# Altium project obc_ver2.PrjPcb (part 3 of 3)

## Sheet obc-v2_MCU-PinOut.SchDoc
size 420 x 297 mm; SheetNumber: 23; SheetTotal: 23
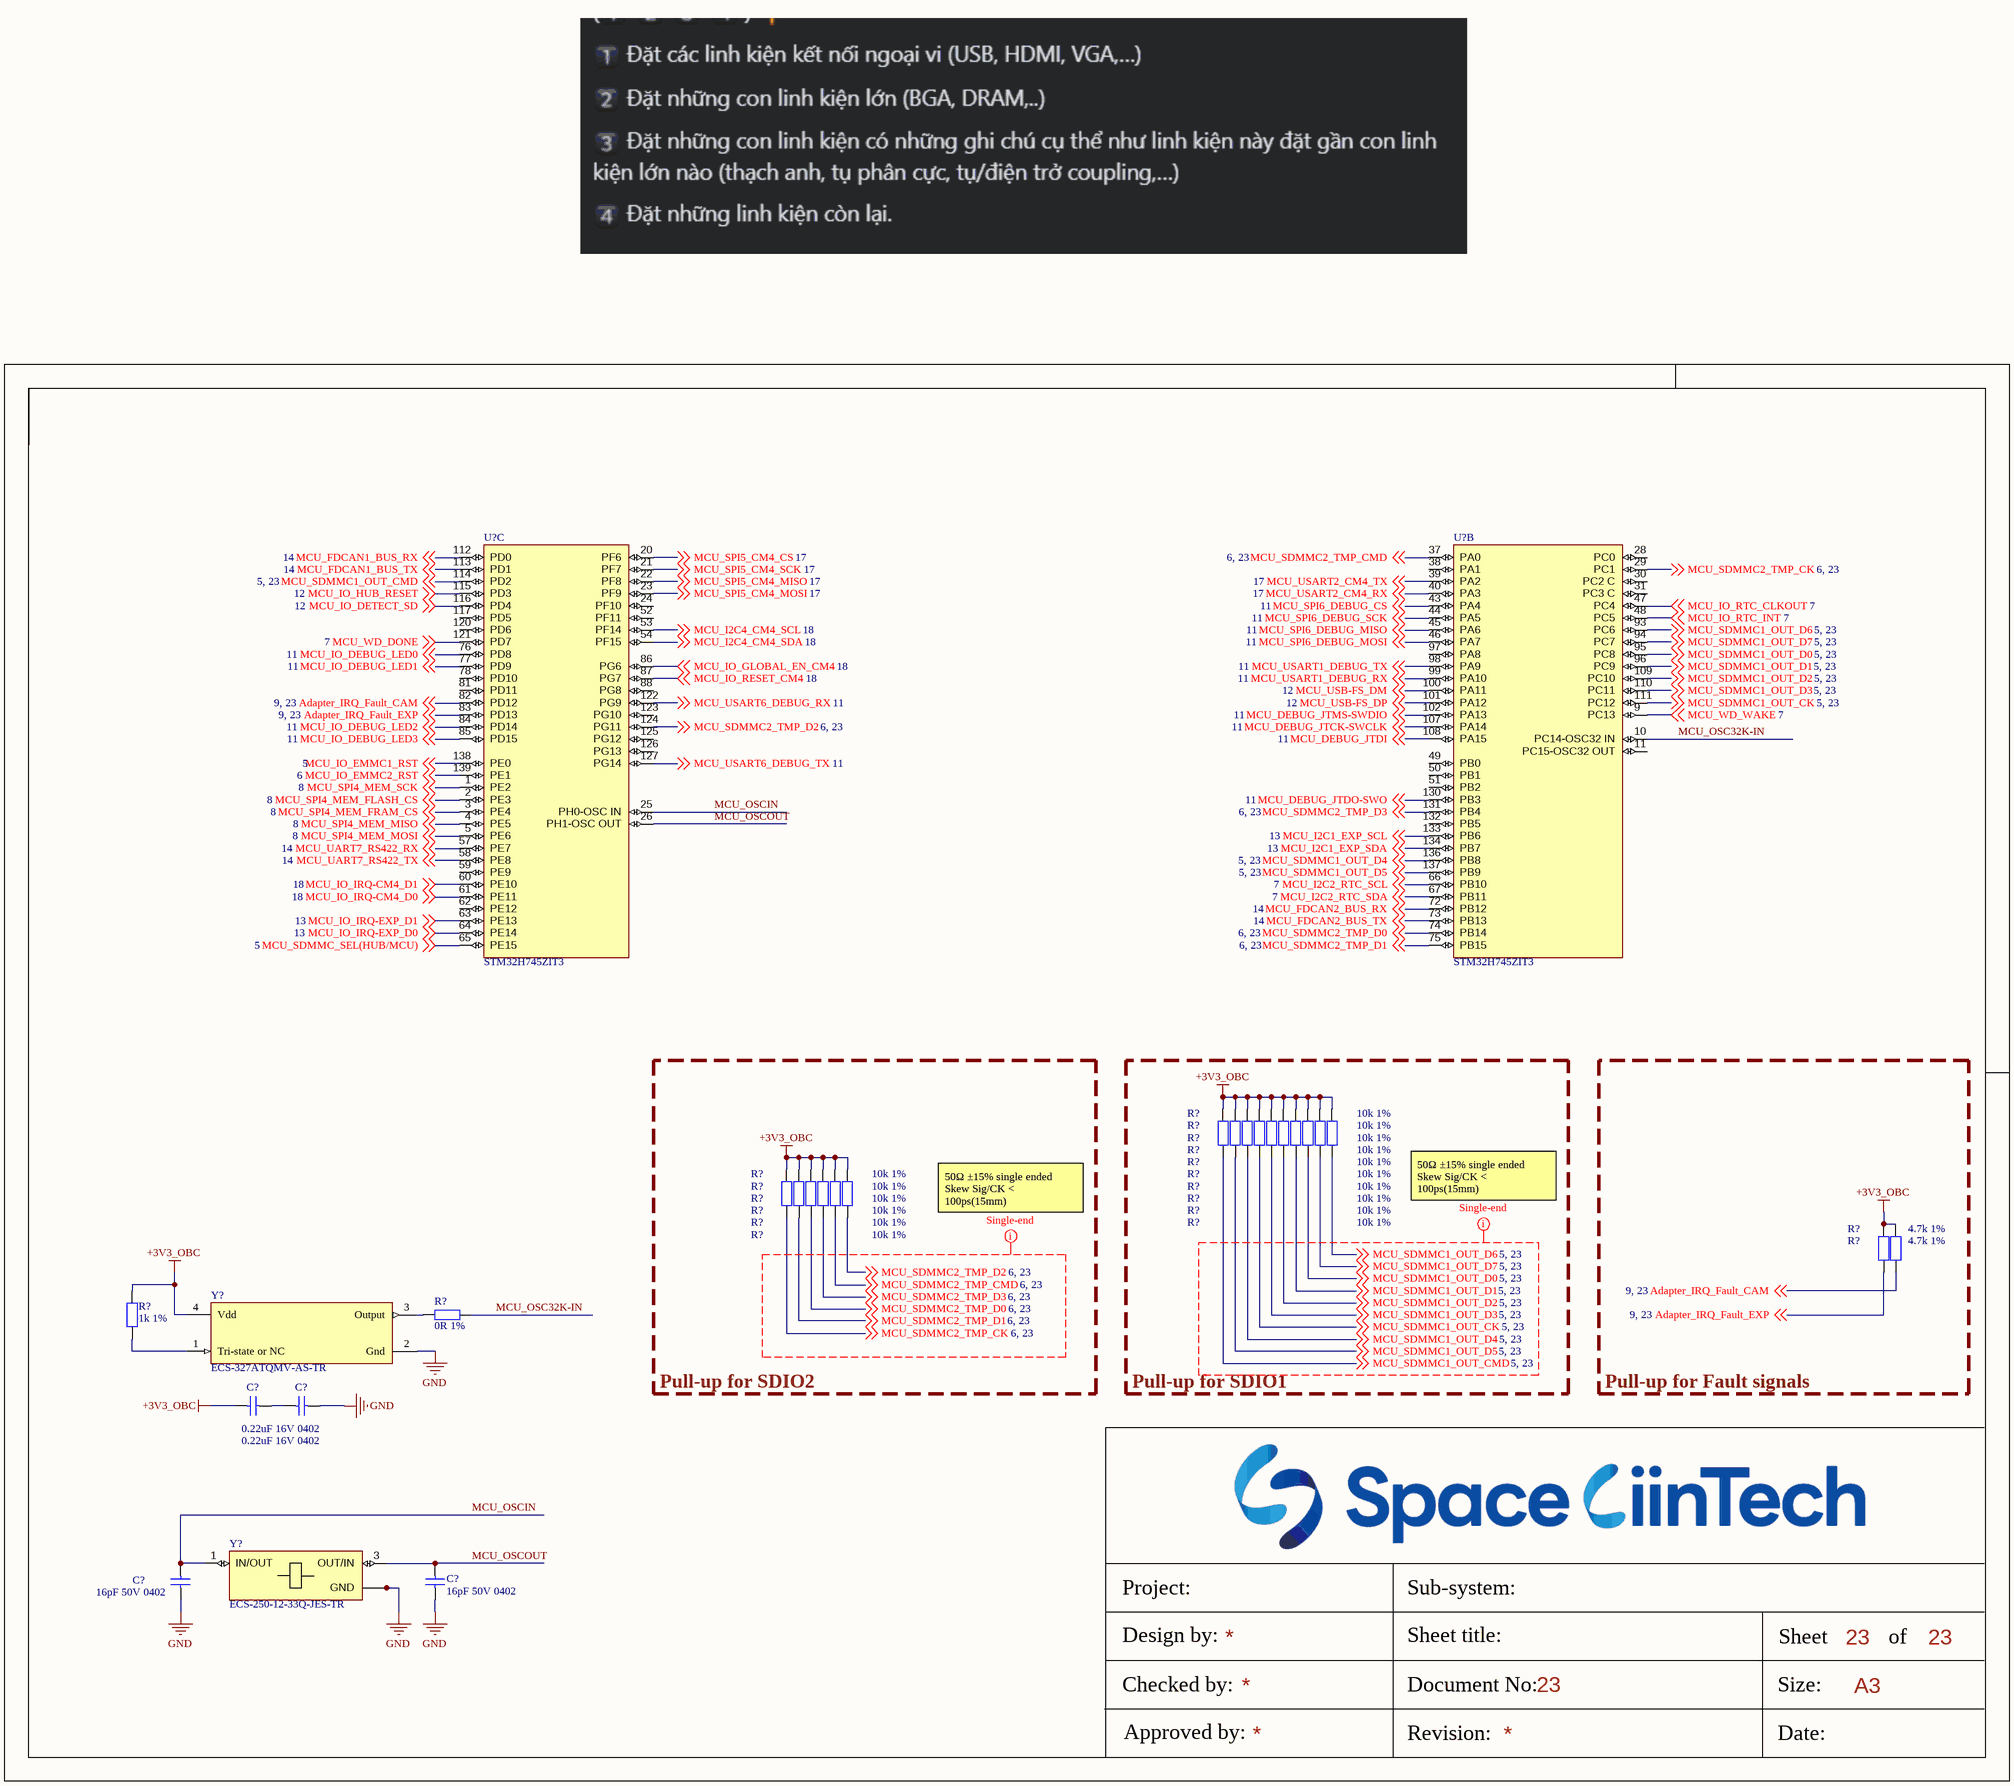
[diagram p23: obc-v2_MCU-PinOut.SchDoc]

### Parts
(Parts that share a designator on the sheet are numbered #1, #2 ... from top to bottom, then left to right.)
C?#221  0.22uF 16V 0402  [tu 0402]
C?#222  0.22uF 16V 0402  [tu 0402]
C?#223  16pF 50V 0402  [tu 0402]
C?#224  16pF 50V 0402  [tu 0402]
R?#90  10k 1%  [tro smd 0603]
R?#91  10k 1%  [tro smd 0603]
R?#92  10k 1%  [tro smd 0603]
R?#93  10k 1%  [tro smd 0603]
R?#94  10k 1%  [tro smd 0603]
R?#95  10k 1%  [tro smd 0603]
R?#96  10k 1%  [tro smd 0603]
R?#97  10k 1%  [tro smd 0603]
R?#98  10k 1%  [tro smd 0603]
R?#99  10k 1%  [tro smd 0603]
R?#100  10k 1%  [tro smd 0603]
R?#101  10k 1%  [tro smd 0603]
R?#102  10k 1%  [tro smd 0603]
R?#103  10k 1%  [tro smd 0603]
R?#104  10k 1%  [tro smd 0603]
R?#105  10k 1%  [tro smd 0603]
R?#106  4.7k 1%  [tro smd 0603]
R?#107  4.7k 1%  [tro smd 0603]
R?#108  1k 1%  [tro smd 0603]
R?#109  0R 1%  [tro smd 0603]
U?#30  STM32H745ZIT3  [FP-LQFP144-1A-MFG]  (part C of 3)
U?#31  STM32H745ZIT3  [FP-LQFP144-1A-MFG]  (part B of 3)
Y?#3  ECS-327ATQMV-AS-TR  [FP-327ATQMV-MFG]
Y?#4  ECS-250-12-33Q-JES-TR  [XTAL_ECS-250-12-33Q-JES-TR]

### Blocks framed on the sheet
Pull-up for SDIO2: R?#100-R?#105
Pull-up for SDIO1: R?#90-R?#99
Pull-up for Fault signals: R?#106 R?#107

### Nets
+3V3_OBC: C?#221.1 R?#90.2 R?#91.2 R?#92.2 R?#93.2 R?#94.2 R?#95.2 R?#96.2 R?#97.2 R?#98.2 R?#99.2 R?#100.2 R?#101.2 R?#102.2 R?#103.2 R?#104.2 R?#105.2 R?#106.2 R?#107.2 R?#108.1 Y?#3.4(Vdd)
GND: C?#222.2 C?#223.1 C?#224.1 Y?#3.2(Gnd) Y?#4.2(GND) Y?#4.4(GND)
Adapter_IRQ_Fault_CAM: R?#107.1 U?#30.82(PD12) ; off-sheet Adapter_IRQ_Fault_CAM
Adapter_IRQ_Fault_EXP: R?#106.1 U?#30.83(PD13) ; off-sheet Adapter_IRQ_Fault_EXP
MCU_DEBUG_JTCK-SWCLK: U?#31.107(PA14) ; off-sheet MCU_DEBUG_JTCK-SWCLK
MCU_DEBUG_JTDI: U?#31.108(PA15) ; off-sheet MCU_DEBUG_JTDI
MCU_DEBUG_JTDO-SWO: U?#31.130(PB3) ; off-sheet MCU_DEBUG_JTDO-SWO
MCU_DEBUG_JTMS-SWDIO: U?#31.102(PA13) ; off-sheet MCU_DEBUG_JTMS-SWDIO
MCU_FDCAN1_BUS_RX: U?#30.112(PD0) ; off-sheet MCU_FDCAN1_BUS_RX
MCU_FDCAN1_BUS_TX: U?#30.113(PD1) ; off-sheet MCU_FDCAN1_BUS_TX
MCU_FDCAN2_BUS_RX: U?#31.72(PB12) ; off-sheet MCU_FDCAN2_BUS_RX
MCU_FDCAN2_BUS_TX: U?#31.73(PB13) ; off-sheet MCU_FDCAN2_BUS_TX
MCU_I2C1_EXP_SCL: U?#31.133(PB6) ; off-sheet MCU_I2C1_EXP_SCL
MCU_I2C1_EXP_SDA: U?#31.134(PB7) ; off-sheet MCU_I2C1_EXP_SDA
MCU_I2C2_RTC_SCL: U?#31.66(PB10) ; off-sheet MCU_I2C2_RTC_SCL
MCU_I2C2_RTC_SDA: U?#31.67(PB11) ; off-sheet MCU_I2C2_RTC_SDA
MCU_I2C4_CM4_SCL: U?#30.53(PF14) ; off-sheet MCU_I2C4_CM4_SCL
MCU_I2C4_CM4_SDA: U?#30.54(PF15) ; off-sheet MCU_I2C4_CM4_SDA
MCU_IO_DEBUG_LED0: U?#30.76(PD8) ; off-sheet MCU_IO_DEBUG_LED0
MCU_IO_DEBUG_LED1: U?#30.77(PD9) ; off-sheet MCU_IO_DEBUG_LED1
MCU_IO_DEBUG_LED2: U?#30.84(PD14) ; off-sheet MCU_IO_DEBUG_LED2
MCU_IO_DEBUG_LED3: U?#30.85(PD15) ; off-sheet MCU_IO_DEBUG_LED3
MCU_IO_DETECT_SD: U?#30.116(PD4) ; off-sheet MCU_IO_DETECT_SD  [project net MCU_DETECT_SD]
MCU_IO_EMMC1_RST: U?#30.138(PE0) ; off-sheet MCU_IO_EMMC1_RST  [project net EMMC1_RST]
MCU_IO_EMMC2_RST: U?#30.139(PE1) ; off-sheet MCU_IO_EMMC2_RST  [project net EMMC2_RST]
MCU_IO_GLOBAL_EN_CM4: U?#30.86(PG6) ; off-sheet MCU_IO_GLOBAL_EN_CM4
MCU_IO_HUB_RESET: U?#30.115(PD3) ; off-sheet MCU_IO_HUB_RESET
MCU_IO_IRQ-CM4_D0: U?#30.61(PE11) ; off-sheet MCU_IO_IRQ-CM4_D0
MCU_IO_IRQ-CM4_D1: U?#30.60(PE10) ; off-sheet MCU_IO_IRQ-CM4_D1
MCU_IO_IRQ-EXP_D0: U?#30.64(PE14) ; off-sheet MCU_IO_IRQ-EXP_D0
MCU_IO_IRQ-EXP_D1: U?#30.63(PE13) ; off-sheet MCU_IO_IRQ-EXP_D1
MCU_IO_RESET_CM4: U?#30.87(PG7) ; off-sheet MCU_IO_RESET_CM4
MCU_IO_RTC_CLKOUT: U?#31.47(PC4) ; off-sheet MCU_IO_RTC_CLKOUT
MCU_IO_RTC_INT: U?#31.48(PC5) ; off-sheet MCU_IO_RTC_INT
MCU_OSC32K-IN: R?#109.1 U?#31.10(PC14-OSC32_IN)
MCU_OSCIN: C?#223.2 U?#30.25(PH0-OSC_IN) Y?#4.1(IN/OUT)
MCU_OSCOUT: C?#224.2 U?#30.26(PH1-OSC_OUT) Y?#4.3(OUT/IN)
MCU_SDMMC1_OUT_CK: R?#93.1 U?#31.111(PC12) ; off-sheet MCU_SDMMC1_OUT_CK
MCU_SDMMC1_OUT_CMD: R?#90.1 U?#30.114(PD2) ; off-sheet MCU_SDMMC1_OUT_CMD
MCU_SDMMC1_OUT_D0: R?#97.1 U?#31.95(PC8) ; off-sheet MCU_SDMMC1_OUT_D0
MCU_SDMMC1_OUT_D1: R?#96.1 U?#31.96(PC9) ; off-sheet MCU_SDMMC1_OUT_D1
MCU_SDMMC1_OUT_D2: R?#95.1 U?#31.109(PC10) ; off-sheet MCU_SDMMC1_OUT_D2
MCU_SDMMC1_OUT_D3: R?#94.1 U?#31.110(PC11) ; off-sheet MCU_SDMMC1_OUT_D3
MCU_SDMMC1_OUT_D4: R?#92.1 U?#31.136(PB8) ; off-sheet MCU_SDMMC1_OUT_D4
MCU_SDMMC1_OUT_D5: R?#91.1 U?#31.137(PB9) ; off-sheet MCU_SDMMC1_OUT_D5
MCU_SDMMC1_OUT_D6: R?#99.1 U?#31.93(PC6) ; off-sheet MCU_SDMMC1_OUT_D6
MCU_SDMMC1_OUT_D7: R?#98.1 U?#31.94(PC7) ; off-sheet MCU_SDMMC1_OUT_D7
MCU_SDMMC2_TMP_CK: R?#100.1 U?#31.29(PC1) ; off-sheet MCU_SDMMC2_TMP_CK  [project net EMMC2_CLK]
MCU_SDMMC2_TMP_CMD: R?#104.1 U?#31.37(PA0) ; off-sheet MCU_SDMMC2_TMP_CMD  [project net EMMC2_CMD]
MCU_SDMMC2_TMP_D0: R?#102.1 U?#31.74(PB14) ; off-sheet MCU_SDMMC2_TMP_D0  [project net EMMC2_DAT0]
MCU_SDMMC2_TMP_D1: R?#101.1 U?#31.75(PB15) ; off-sheet MCU_SDMMC2_TMP_D1  [project net EMMC2_DAT1]
MCU_SDMMC2_TMP_D2: R?#105.1 U?#30.124(PG11) ; off-sheet MCU_SDMMC2_TMP_D2  [project net EMMC2_DAT2]
MCU_SDMMC2_TMP_D3: R?#103.1 U?#31.131(PB4) ; off-sheet MCU_SDMMC2_TMP_D3  [project net EMMC2_DAT3]
MCU_SDMMC_SEL(HUB/MCU): U?#30.65(PE15) ; off-sheet MCU_SDMMC_SEL(HUB/MCU)
MCU_SPI4_MEM_FLASH_CS: U?#30.2(PE3) ; off-sheet MCU_SPI4_MEM_FLASH_CS
MCU_SPI4_MEM_FRAM_CS: U?#30.3(PE4) ; off-sheet MCU_SPI4_MEM_FRAM_CS
MCU_SPI4_MEM_MISO: U?#30.4(PE5) ; off-sheet MCU_SPI4_MEM_MISO
MCU_SPI4_MEM_MOSI: U?#30.5(PE6) ; off-sheet MCU_SPI4_MEM_MOSI
MCU_SPI4_MEM_SCK: U?#30.1(PE2) ; off-sheet MCU_SPI4_MEM_SCK
MCU_SPI5_CM4_CS: U?#30.20(PF6) ; off-sheet MCU_SPI5_CM4_CS
MCU_SPI5_CM4_MISO: U?#30.22(PF8) ; off-sheet MCU_SPI5_CM4_MISO
MCU_SPI5_CM4_MOSI: U?#30.23(PF9) ; off-sheet MCU_SPI5_CM4_MOSI
MCU_SPI5_CM4_SCK: U?#30.21(PF7) ; off-sheet MCU_SPI5_CM4_SCK
MCU_SPI6_DEBUG_CS: U?#31.43(PA4) ; off-sheet MCU_SPI6_DEBUG_CS
MCU_SPI6_DEBUG_MISO: U?#31.45(PA6) ; off-sheet MCU_SPI6_DEBUG_MISO
MCU_SPI6_DEBUG_MOSI: U?#31.46(PA7) ; off-sheet MCU_SPI6_DEBUG_MOSI
MCU_SPI6_DEBUG_SCK: U?#31.44(PA5) ; off-sheet MCU_SPI6_DEBUG_SCK
MCU_UART7_RS422_RX: U?#30.57(PE7) ; off-sheet MCU_UART7_RS422_RX  [project net MCU_RS422_RX]
MCU_UART7_RS422_TX: U?#30.58(PE8) ; off-sheet MCU_UART7_RS422_TX  [project net MCU_RS422_TX]
MCU_USART1_DEBUG_RX: U?#31.99(PA10) ; off-sheet MCU_USART1_DEBUG_RX
MCU_USART1_DEBUG_TX: U?#31.98(PA9) ; off-sheet MCU_USART1_DEBUG_TX
MCU_USART2_CM4_RX: U?#31.40(PA3) ; off-sheet MCU_USART2_CM4_RX
MCU_USART2_CM4_TX: U?#31.39(PA2) ; off-sheet MCU_USART2_CM4_TX
MCU_USART6_DEBUG_RX: U?#30.122(PG9) ; off-sheet MCU_USART6_DEBUG_RX
MCU_USART6_DEBUG_TX: U?#30.127(PG14) ; off-sheet MCU_USART6_DEBUG_TX
MCU_USB-FS_DM: U?#31.100(PA11) ; off-sheet MCU_USB-FS_DM  [project net MCU_USB-FS_HUB_D_N]
MCU_USB-FS_DP: U?#31.101(PA12) ; off-sheet MCU_USB-FS_DP  [project net MCU_USB-FS_HUB_D_P]
MCU_WD_DONE: U?#30.121(PD7) ; off-sheet MCU_WD_DONE
MCU_WD_WAKE: U?#31.9(PC13) ; off-sheet MCU_WD_WAKE
NetC?#221_2: C?#221.2 C?#222.1
NetR?#108_2: R?#108.2 Y?#3.1(Tri-state_or_NC)
NetR?#109_2: R?#109.2 Y?#3.3(Output)

Not connected (* = marked no-connect by the designer): U?#30 24(PF10) 52(PF11) 59(PE9) 62(PE12) 78(PD10) 81(PD11) 88(PG8) 117(PD5) 120(PD6) 123(PG10) 125(PG12) 126(PG13); U?#31 11(PC15-OSC32_OUT) 28(PC0) 30(PC2_C) 31(PC3_C) 38(PA1) 49(PB0) 50(PB1) 51(PB2) 97(PA8) 132(PB5)

### Layout directives
mark named Single-end: MCU_SDMMC1_OUT_CK, MCU_SDMMC1_OUT_CMD, MCU_SDMMC1_OUT_D0, MCU_SDMMC1_OUT_D1, MCU_SDMMC1_OUT_D2, MCU_SDMMC1_OUT_D3, MCU_SDMMC1_OUT_D4, MCU_SDMMC1_OUT_D5, MCU_SDMMC1_OUT_D6, MCU_SDMMC1_OUT_D7, MCU_SDMMC2_TMP_CK, MCU_SDMMC2_TMP_CMD, MCU_SDMMC2_TMP_D0, MCU_SDMMC2_TMP_D1, MCU_SDMMC2_TMP_D2, MCU_SDMMC2_TMP_D3

### Notes on the sheet
- 50Ω ±15% single ended
  Skew Sig/CK < 100ps(15mm)
  Max Length 100mm
- Project:
- Sub-system:
- Design by:
- Sheet title:
- Sheet
- A3
- of
- Checked by:
- Approved by:
- Revision:
- Document No:
- Size:
- Date:

### Library data of the parts
C?#221 C?#222 = Tu 0402 33nF 10V: as C?#128-C?#141 on sheet obc-v2_CM4-PinOut; Kieu_Chan: *
C?#223 C?#224 = Tu 0402 33nF 10V: 16 pF ±1% 50V Ceramic Capacitor C0G, NP0 0402 (1005 Metric): GJM1555C1H160FB01J; Chung_Loai: Dán; Don_Vi: Con; So_Chan: 2; Ten_Linh_Kien: Tụ 0402 33nF X7R 10V GRM155R71A333KA01D; Ma_Hang: MH007853; Kieu_Chan: *
R?#90-R?#109 = Tro 0603 1% 10k: RES 4.7K OHM 1% 1/10W 0603, P/N: ERJ-U03F4701V; Chung_Loai: Dán; Don_Vi: Con; So_Chan: 2; Ten_Linh_Kien: Trở 0603 1% 10k; Ma_Hang: MH006333; Kieu_Chan: *
U?#30 U?#31 = CMP-12105-000054-1: HIGH-PERFORMANCE AND DSP WITH DP; Manufacturer Part Number: STM32H745ZIT6; Manufacturer: STMicroelectronics; Number Of Timers/Counters: 20; Min Supply Voltage: 1.62V; Frequency: 480MHz; Number Of I2C Channels: 4; Memory Type: FLASH; Number Of I/Os: 97; Number Of Pwm Channels: 42; Number Of Usb Channels: 2; Ram Size: 1MBytes; Memory Size: 2MBytes; Data Bus Width: 32bits; Number Of Adc Channels: 23; Number Of Ethernet Channels: 1; Number Of Uart Channels: 9; Interface: I2C,SPI,UART,USART,CAN,USB,LIN,IrDA,Ethernet,I2S,Other; Number Of A/D Converters: 3; Max Junction Temp: +125°C; Max Supply Voltage: 3.6V; Core Architecture: ARM Cortex-M4, Cortex-M7; Number Of Spi Channels: 6; Standoff Height: 0.05mm; Ambient Temperature Range Low: -40°C; Lead Free: Yes; Automotive: No; Height: 1.6mm; Device Class L1: Integrated Circuits (ICs); Ambient Temperature Range High: +85°C; RoHS: TRUE; Temperature Range High: +125°C; Temperature: -40°C to +125°C; Category: IC; Device Class L2: Embedded Processors and Controllers; Number Of Cores: 2; Temperature Range Low: -40°C; Octopart: https://octopart.com/stm32h745zit6-stmicroelectronics-100293939; Digikey Description: HIGH-PERFORMANCE AND DSP WITH DP; Package: LQFP144-1A; Device Class L3: Microcontrollers; ComponentLink2URL: https://www.st.com/resource/en/datasheet/stm32h745zi.pdf; ComponentLink2Description: Datasheet
Y?#3 = CMP-40224-000027-1: XTAL OSC XO 32.7680KHZ CMOS SMD; RoHS Compliant: Yes
Y?#4 = ECS-250-12-33Q-JES-TR: 25 MHz Â±20ppm Crystal 12pF 40 Ohms 4-SMD, No Lead; MF: ECS Inc.; Value: *; Purchase-URL: https://pricing.snapeda.com/search/part/ECS-250-12-33Q-JES-TR/?ref=eda; Package: ECS-33B ECS Inc.; Availability: In Stock; SnapEDA_Link: https://www.snapeda.com/parts/ECS-250-12-33Q-JES-TR/ECS+Inc./view-part/?ref=snap; MP: ECS-250-12-33Q-JES-TR; Check_prices: https://www.snapeda.com/parts/ECS-250-12-33Q-JES-TR/ECS+Inc./view-part/?ref=eda; Price: None

## Nets that join several sheets
+3V3_CM4: obc-v2_CM4-PinOut (9 pins), obc-v2_CM4-SPI-UART (6 pins), obc-v2_CM4-IRQ-CTRL (10 pins), obc-v2_CM4-FUNCTION (D?#15.2 D?#16.2), obc-v2_CM4-CSI (J?#28.22 R?#84.1 R?#85.1), obc-v2_CM4-POWER (C?#164.1 R?#86.2 U?#28.4 U?#28.5)
+3V3_CM4-OUT: obc-v2_CM4-PinOut (R?#62.1), obc-v2_CM4-POWER (CM4.84 CM4.86 R?#87.2 TP?#7.0)
+3V3_M2: obc-v2_BOARD-CONNECT (J?#5.5), obc-v2_CM4-M2 (48 pins), obc-v2_CM4-PinOut (14 pins), obc-v2_CM4-SPI-UART (5 pins), obc-v2_CM4-IRQ-CTRL (IC?.4 U?#26.4 U?#27.4), obc-v2_CM4-FUNCTION (5 pins), obc-v2_CM4-POWER (66 pins)
+3V3_OBC: obc-v2_POWER (5 pins), obc-v2_OUT-eMMC (33 pins), obc-v2_TMP-eMMC (27 pins), obc-v2_RTC-WDOG (11 pins), obc-v2_FRAM-FLASH (8 pins), obc-v2_DEBUG (J?#6.1 J?#14.1), obc-v2_USB-HUB (31 pins), obc-v2_EXP-I2C-IRQ (8 pins), obc-v2_EXP-CAN-RS422 (10 pins), obc-v2_CM4-PinOut (5 pins), obc-v2_CM4-SPI-UART (5 pins), obc-v2_CM4-IRQ-CTRL (12 pins), obc-v2_MCU-POWER (41 pins), obc-v2_MCU-PinOut (21 pins)
+5V_AUX-Adaptor: obc-v2_BOARD-CONNECT (J.3 J.4 J?#3.21), obc-v2_CM4-M2 (C?#118.1 C?#122.1 U?#21.3), obc-v2_CM4-PinOut (J?#20.2), obc-v2_CM4-POWER (18 pins)
+5V_EXP-ISO: obc-v2_BOARD-CONNECT (J?#3.9), obc-v2_EXP-I2C-IRQ (9 pins), obc-v2_EXP-CAN-RS422 (6 pins)
+5V_USB-Adaptor: obc-v2_POWER (C?#1.1 C?#2.1 U?#1.1 U?#1.2), obc-v2_BOARD-CONNECT (5 pins), obc-v2_DEBUG (J?#14.2)
GND: obc-v2_POWER (6 pins), obc-v2_OUT-eMMC (37 pins), obc-v2_TMP-eMMC (29 pins), obc-v2_RTC-WDOG (11 pins), obc-v2_FRAM-FLASH (C?#57.2 C?#59.2 U.4 U?#12.4), obc-v2_BOARD-CONNECT (C?#62.1 D?#3.2 J.9), obc-v2_DEBUG (12 pins), obc-v2_USB-HUB (36 pins), obc-v2_EXP-I2C-IRQ (C?#98.2 C?#102.2 U?#16.4 U?#17.4), obc-v2_EXP-CAN-RS422 (8 pins), obc-v2_CM4-M2 (J?#18.1), obc-v2_CM4-PinOut (5 pins), obc-v2_CM4-SPI-UART (5 pins), obc-v2_CM4-IRQ-CTRL (9 pins), obc-v2_MCU-POWER (40 pins), obc-v2_MCU-PinOut (6 pins)
GND-CM4: obc-v2_BOARD-CONNECT (11 pins), obc-v2_CM4-CSI (9 pins)
GND_EXP: obc-v2_EXP-I2C-IRQ (5 pins), obc-v2_EXP-CAN-RS422 (7 pins)
Adapter_IRQ_Fault_CAM: obc-v2_BOARD-CONNECT (J.5), obc-v2_MCU-PinOut (R?#107.1 U?#30.82)
Adapter_IRQ_Fault_EXP: obc-v2_BOARD-CONNECT (J.12), obc-v2_MCU-PinOut (R?#106.1 U?#30.83)
CAM0_CK_N: obc-v2_BOARD-CONNECT (J?#3.15), obc-v2_CM4-CSI (CM4.140)
CAM0_CK_P: obc-v2_BOARD-CONNECT (J?#3.36), obc-v2_CM4-CSI (CM4.142)
CAM0_D0_N: obc-v2_BOARD-CONNECT (J?#3.11), obc-v2_CM4-CSI (CM4.128)
CAM0_D0_P: obc-v2_BOARD-CONNECT (J?#3.32), obc-v2_CM4-CSI (CM4.130)
CAM0_D1_N: obc-v2_BOARD-CONNECT (J?#3.13), obc-v2_CM4-CSI (CM4.134)
CAM0_D1_P: obc-v2_BOARD-CONNECT (J?#3.34), obc-v2_CM4-CSI (CM4.136)
CM4_CS_CAMIO1: obc-v2_CM4-PinOut (CM4.41), obc-v2_CM4-CSI (J?#28.18)
CM4_ENABLE: obc-v2_CM4-IRQ-CTRL (U?#27.2), obc-v2_CM4-FUNCTION (J?#23.1 R?#80.2)
CM4_I2C4_ToCAM_SCL: obc-v2_BOARD-CONNECT (J?#3.20), obc-v2_CM4-PinOut (CM4.37)
CM4_I2C4_ToCAM_SDA: obc-v2_BOARD-CONNECT (J?#3.41), obc-v2_CM4-PinOut (CM4.30)
CM4_I2C_ToCAM_SCL: obc-v2_BOARD-CONNECT (J?#3.17), obc-v2_CM4-CSI (CM4.35 R?#85.2)
CM4_I2C_ToCAM_SDA: obc-v2_BOARD-CONNECT (J?#3.38), obc-v2_CM4-CSI (CM4.36 R?#84.2)
CM4_I2CSlave_ToOBC_SCL: obc-v2_CM4-PinOut (CM4.38), obc-v2_CM4-IRQ-CTRL (IC?.3 R?#70.1)
CM4_I2CSlave_ToOBC_SDA: obc-v2_CM4-PinOut (CM4.44), obc-v2_CM4-IRQ-CTRL (IC?.2 R?#71.1)
CM4_IO_ToCAM_CAMIO0: obc-v2_BOARD-CONNECT (J?#3.37), obc-v2_CM4-CSI (CM4.97 J?#28.17)
CM4_IO_ToCAM_CAMIO1: obc-v2_BOARD-CONNECT (J?#3.16), obc-v2_CM4-PinOut (CM4.24)
CM4_IO_ToCAM_SEL0: obc-v2_BOARD-CONNECT (J?#3.40), obc-v2_CM4-PinOut (CM4.29)
CM4_IO_ToCAM_SEL1: obc-v2_BOARD-CONNECT (J?#3.19), obc-v2_CM4-PinOut (CM4.50)
CM4_IO_ToOBC_IRQ0: obc-v2_CM4-PinOut (CM4.45), obc-v2_CM4-IRQ-CTRL (R?#75.1 U?#26.2)
CM4_IO_ToOBC_IRQ1: obc-v2_CM4-PinOut (CM4.40), obc-v2_CM4-IRQ-CTRL (R?#74.1 U?#26.3)
CM4_RESET: obc-v2_CM4-IRQ-CTRL (U?#27.3), obc-v2_CM4-FUNCTION (J?#27.1 R?#83.2)
CM4_SPI1_ISO_CS: obc-v2_CM4-PinOut (CM4.49), obc-v2_CM4-SPI-UART (R?#69.1 U?#24.5)
CM4_SPI1_ISO_MISO: obc-v2_CM4-PinOut (CM4.26), obc-v2_CM4-SPI-UART (U?#24.6)
CM4_SPI1_ISO_MOSI: obc-v2_CM4-PinOut (CM4.27), obc-v2_CM4-SPI-UART (U?#24.4)
CM4_SPI1_ISO_SCK: obc-v2_CM4-PinOut (CM4.25), obc-v2_CM4-SPI-UART (U?#24.3)
CM4_UART3_ToOBC_RX: obc-v2_CM4-PinOut (CM4.34), obc-v2_CM4-SPI-UART (U?#25.2)
CM4_UART3_ToOBC_TX: obc-v2_CM4-PinOut (CM4.54), obc-v2_CM4-SPI-UART (U?#25.3)
CM4_USB-FS_HUB_D_N: obc-v2_USB-HUB (U?#13.3), obc-v2_CM4-PinOut (U?#22.7)
CM4_USB-FS_HUB_D_P: obc-v2_USB-HUB (U?#13.4), obc-v2_CM4-PinOut (U?#22.8)
EMMC1_RST: obc-v2_OUT-eMMC (R?#4.2 U?#3.M5), obc-v2_MCU-PinOut (U?#30.138)
EMMC2_CLK: obc-v2_TMP-eMMC (U?#7.P6), obc-v2_MCU-PinOut (R?#100.1 U?#31.29)
EMMC2_CMD: obc-v2_TMP-eMMC (U?#7.P5), obc-v2_MCU-PinOut (R?#104.1 U?#31.37)
EMMC2_DAT0: obc-v2_TMP-eMMC (U?#7.K2), obc-v2_MCU-PinOut (R?#102.1 U?#31.74)
EMMC2_DAT1: obc-v2_TMP-eMMC (U?#7.N2), obc-v2_MCU-PinOut (R?#101.1 U?#31.75)
EMMC2_DAT2: obc-v2_TMP-eMMC (U?#7.K3), obc-v2_MCU-PinOut (R?#105.1 U?#30.124)
EMMC2_DAT3: obc-v2_TMP-eMMC (U?#7.N3), obc-v2_MCU-PinOut (R?#103.1 U?#31.131)
EMMC2_RST: obc-v2_TMP-eMMC (R?#7.2 U?#7.M5), obc-v2_MCU-PinOut (U?#30.139)
HUB_SDMMC1_CLK: obc-v2_OUT-eMMC (TP?#2.0 U?#2.13), obc-v2_USB-HUB (U?#13.21)
HUB_SDMMC1_CMD: obc-v2_OUT-eMMC (U?#2.8), obc-v2_USB-HUB (U?#13.24)
HUB_SDMMC1_D0: obc-v2_OUT-eMMC (U?#2.14), obc-v2_USB-HUB (U?#13.18)
HUB_SDMMC1_D1: obc-v2_OUT-eMMC (U?#2.15), obc-v2_USB-HUB (U?#13.17)
HUB_SDMMC1_D2: obc-v2_OUT-eMMC (U?#2.12), obc-v2_USB-HUB (U?#13.33)
HUB_SDMMC1_D3: obc-v2_OUT-eMMC (U?#2.10), obc-v2_USB-HUB (U?#13.32)
HUB_SDMMC1_D4: obc-v2_OUT-eMMC (U?#5.8), obc-v2_USB-HUB (U?#13.30)
HUB_SDMMC1_D5: obc-v2_OUT-eMMC (U?#5.10), obc-v2_USB-HUB (U?#13.23)
HUB_SDMMC1_D6: obc-v2_OUT-eMMC (U?#5.12), obc-v2_USB-HUB (U?#13.20)
HUB_SDMMC1_D7: obc-v2_OUT-eMMC (U?#5.14), obc-v2_USB-HUB (U?#13.19)
HUB_USB-FS_D_N: obc-v2_BOARD-CONNECT (D?#3.3 D?#3.4 J.8 J?#5.2), obc-v2_USB-HUB (U?#13.43)
HUB_USB-FS_D_P: obc-v2_BOARD-CONNECT (D?#3.1 D?#3.6 J.1 J?#5.3), obc-v2_USB-HUB (U?#13.42)
MCU_BOOT0: obc-v2_DEBUG (J?#11.1), obc-v2_MCU-POWER (R?#88.2 U?#29.135)
MCU_DEBUG_JTCK-SWCLK: obc-v2_DEBUG (J?#7.3 J?#13.2), obc-v2_MCU-PinOut (U?#31.107)
MCU_DEBUG_JTDI: obc-v2_DEBUG (J?#7.1), obc-v2_MCU-PinOut (U?#31.108)
MCU_DEBUG_JTDO-SWO: obc-v2_DEBUG (J?#7.4), obc-v2_MCU-PinOut (U?#31.130)
MCU_DEBUG_JTMS-SWDIO: obc-v2_DEBUG (J?#7.2 J?#13.3), obc-v2_MCU-PinOut (U?#31.102)
MCU_DETECT_SD: obc-v2_USB-HUB (R?#31.2 U?#13.14), obc-v2_MCU-PinOut (U?#30.116)
MCU_FDCAN1_BUS_RX: obc-v2_EXP-CAN-RS422 (U?#18.3), obc-v2_MCU-PinOut (U?#30.112)
MCU_FDCAN1_BUS_TX: obc-v2_EXP-CAN-RS422 (R?#47.1 U?#18.2), obc-v2_MCU-PinOut (U?#30.113)
MCU_FDCAN2_BUS_RX: obc-v2_EXP-CAN-RS422 (U?#19.3), obc-v2_MCU-PinOut (U?#31.72)
MCU_FDCAN2_BUS_TX: obc-v2_EXP-CAN-RS422 (R?#50.1 U?#19.2), obc-v2_MCU-PinOut (U?#31.73)
MCU_I2C1_EXP_SCL: obc-v2_EXP-I2C-IRQ (R?#43.1 U?#17.3), obc-v2_MCU-PinOut (U?#31.133)
MCU_I2C1_EXP_SDA: obc-v2_EXP-I2C-IRQ (R?#44.1 U?#17.2), obc-v2_MCU-PinOut (U?#31.134)
MCU_I2C2_RTC_SCL: obc-v2_RTC-WDOG (R?#10.1 U?#10.4), obc-v2_MCU-PinOut (U?#31.66)
MCU_I2C2_RTC_SDA: obc-v2_RTC-WDOG (R?#11.1 U?#10.5), obc-v2_MCU-PinOut (U?#31.67)
MCU_I2C4_CM4_SCL: obc-v2_CM4-IRQ-CTRL (IC?.6 R?#72.1), obc-v2_MCU-PinOut (U?#30.53)
MCU_I2C4_CM4_SDA: obc-v2_CM4-IRQ-CTRL (IC?.7 R?#73.1), obc-v2_MCU-PinOut (U?#30.54)
MCU_IO_DEBUG_LED0: obc-v2_DEBUG (R?#22.2), obc-v2_MCU-PinOut (U?#30.76)
MCU_IO_DEBUG_LED1: obc-v2_DEBUG (R?#23.2), obc-v2_MCU-PinOut (U?#30.77)
MCU_IO_DEBUG_LED2: obc-v2_DEBUG (R?#24.2), obc-v2_MCU-PinOut (U?#30.84)
MCU_IO_DEBUG_LED3: obc-v2_DEBUG (R?#25.2), obc-v2_MCU-PinOut (U?#30.85)
MCU_IO_GLOBAL_EN_CM4: obc-v2_CM4-IRQ-CTRL (R?#79.1 U?#27.7), obc-v2_MCU-PinOut (U?#30.86)
MCU_IO_HUB_RESET: obc-v2_USB-HUB (C?#68.1 R?#28.2 TP?#5.0 U?#13.38), obc-v2_MCU-PinOut (U?#30.115)
MCU_IO_IRQ-CM4_D0: obc-v2_CM4-IRQ-CTRL (R?#77.1 U?#26.7), obc-v2_MCU-PinOut (U?#30.61)
MCU_IO_IRQ-CM4_D1: obc-v2_CM4-IRQ-CTRL (R?#76.1 U?#26.6), obc-v2_MCU-PinOut (U?#30.60)
MCU_IO_IRQ-EXP_D0: obc-v2_EXP-I2C-IRQ (R?#38.1 U?#16.3), obc-v2_MCU-PinOut (U?#30.64)
MCU_IO_IRQ-EXP_D1: obc-v2_EXP-I2C-IRQ (R?#39.1 U?#16.2), obc-v2_MCU-PinOut (U?#30.63)
MCU_IO_RESET_CM4: obc-v2_CM4-IRQ-CTRL (R?#78.1 U?#27.6), obc-v2_MCU-PinOut (U?#30.87)
MCU_IO_RTC_CLKOUT: obc-v2_RTC-WDOG (R?#8.1 U?#10.3), obc-v2_MCU-PinOut (U?#31.47)
MCU_IO_RTC_INT: obc-v2_RTC-WDOG (R?#9.1 U?#10.7), obc-v2_MCU-PinOut (U?#31.48)
MCU_~{RST}: obc-v2_RTC-WDOG (5 pins), obc-v2_DEBUG (J?#9.1 J?#13.1), obc-v2_MCU-POWER (U?#29.27)
MCU_RS422_RX: obc-v2_EXP-CAN-RS422 (R?#54.1 U?#20.3), obc-v2_MCU-PinOut (U?#30.57)
MCU_RS422_TX: obc-v2_EXP-CAN-RS422 (U?#20.6), obc-v2_MCU-PinOut (U?#30.58)
MCU_SDMMC1_OUT_CK: obc-v2_OUT-eMMC (U?#2.19), obc-v2_MCU-PinOut (R?#93.1 U?#31.111)
MCU_SDMMC1_OUT_CMD: obc-v2_OUT-eMMC (U?#2.23), obc-v2_MCU-PinOut (R?#90.1 U?#30.114)
MCU_SDMMC1_OUT_D0: obc-v2_OUT-eMMC (U?#2.18), obc-v2_MCU-PinOut (R?#97.1 U?#31.95)
MCU_SDMMC1_OUT_D1: obc-v2_OUT-eMMC (U?#2.16), obc-v2_MCU-PinOut (R?#96.1 U?#31.96)
MCU_SDMMC1_OUT_D2: obc-v2_OUT-eMMC (U?#2.20), obc-v2_MCU-PinOut (R?#95.1 U?#31.109)
MCU_SDMMC1_OUT_D3: obc-v2_OUT-eMMC (U?#2.22), obc-v2_MCU-PinOut (R?#94.1 U?#31.110)
MCU_SDMMC1_OUT_D4: obc-v2_OUT-eMMC (U?#5.23), obc-v2_MCU-PinOut (R?#92.1 U?#31.136)
MCU_SDMMC1_OUT_D5: obc-v2_OUT-eMMC (U?#5.22), obc-v2_MCU-PinOut (R?#91.1 U?#31.137)
MCU_SDMMC1_OUT_D6: obc-v2_OUT-eMMC (U?#5.20), obc-v2_MCU-PinOut (R?#99.1 U?#31.93)
MCU_SDMMC1_OUT_D7: obc-v2_OUT-eMMC (U?#5.18), obc-v2_MCU-PinOut (R?#98.1 U?#31.94)
MCU_SDMMC_SEL(HUB/MCU): obc-v2_OUT-eMMC (6 pins), obc-v2_MCU-PinOut (U?#30.65)
MCU_SPI4_MEM_FLASH_CS: obc-v2_FRAM-FLASH (R?#19.1 U?#12.1), obc-v2_MCU-PinOut (U?#30.2)
MCU_SPI4_MEM_FRAM_CS: obc-v2_FRAM-FLASH (R?#20.1 U.1), obc-v2_MCU-PinOut (U?#30.3)
MCU_SPI4_MEM_MISO: obc-v2_FRAM-FLASH (U.2 U?#12.2), obc-v2_MCU-PinOut (U?#30.4)
MCU_SPI4_MEM_MOSI: obc-v2_FRAM-FLASH (U.5 U?#12.5), obc-v2_MCU-PinOut (U?#30.5)
MCU_SPI4_MEM_SCK: obc-v2_FRAM-FLASH (U.6 U?#12.6), obc-v2_MCU-PinOut (U?#30.1)
MCU_SPI5_CM4_CS: obc-v2_CM4-SPI-UART (U?#24.12), obc-v2_MCU-PinOut (U?#30.20)
MCU_SPI5_CM4_MISO: obc-v2_CM4-SPI-UART (U?#24.11), obc-v2_MCU-PinOut (U?#30.22)
MCU_SPI5_CM4_MOSI: obc-v2_CM4-SPI-UART (U?#24.13), obc-v2_MCU-PinOut (U?#30.23)
MCU_SPI5_CM4_SCK: obc-v2_CM4-SPI-UART (U?#24.14), obc-v2_MCU-PinOut (U?#30.21)
MCU_SPI6_DEBUG_CS: obc-v2_DEBUG (J?#12.1), obc-v2_MCU-PinOut (U?#31.43)
MCU_SPI6_DEBUG_MISO: obc-v2_DEBUG (J?#12.3), obc-v2_MCU-PinOut (U?#31.45)
MCU_SPI6_DEBUG_MOSI: obc-v2_DEBUG (J?#12.4), obc-v2_MCU-PinOut (U?#31.46)
MCU_SPI6_DEBUG_SCK: obc-v2_DEBUG (J?#12.2), obc-v2_MCU-PinOut (U?#31.44)
MCU_USART1_DEBUG_RX: obc-v2_DEBUG (J?#8.3), obc-v2_MCU-PinOut (U?#31.99)
MCU_USART1_DEBUG_TX: obc-v2_DEBUG (J?#8.2), obc-v2_MCU-PinOut (U?#31.98)
MCU_USART2_CM4_RX: obc-v2_CM4-SPI-UART (U?#25.6), obc-v2_MCU-PinOut (U?#31.40)
MCU_USART2_CM4_TX: obc-v2_CM4-SPI-UART (U?#25.7), obc-v2_MCU-PinOut (U?#31.39)
MCU_USART6_DEBUG_RX: obc-v2_DEBUG (J?#10.3), obc-v2_MCU-PinOut (U?#30.122)
MCU_USART6_DEBUG_TX: obc-v2_DEBUG (J?#10.2), obc-v2_MCU-PinOut (U?#30.127)
MCU_USB-FS_HUB_D_N: obc-v2_USB-HUB (U?#13.1), obc-v2_MCU-PinOut (U?#31.100)
MCU_USB-FS_HUB_D_P: obc-v2_USB-HUB (U?#13.2), obc-v2_MCU-PinOut (U?#31.101)
MCU_WD_DONE: obc-v2_RTC-WDOG (U?#11.4), obc-v2_MCU-PinOut (U?#30.121)
MCU_WD_WAKE: obc-v2_RTC-WDOG (U?#11.5), obc-v2_MCU-PinOut (U?#31.9)
NetJ?#3_4: obc-v2_BOARD-CONNECT (J?#3.4), obc-v2_EXP-CAN-RS422 (R?#48.2 R?#49.1 U?#18.7)
NetJ?#3_5: obc-v2_BOARD-CONNECT (J?#3.5), obc-v2_EXP-I2C-IRQ (R?#45.1 U?#17.6)
NetJ?#3_8: obc-v2_BOARD-CONNECT (J?#3.8), obc-v2_EXP-I2C-IRQ (R?#41.1 U?#16.7)
NetJ?#3_25: obc-v2_BOARD-CONNECT (J?#3.25), obc-v2_EXP-CAN-RS422 (R?#48.1 R?#52.1 U?#18.6)
NetJ?#3_26: obc-v2_BOARD-CONNECT (J?#3.26), obc-v2_EXP-I2C-IRQ (R?#46.1 U?#17.7)
NetJ?#3_29: obc-v2_BOARD-CONNECT (J?#3.29), obc-v2_EXP-I2C-IRQ (R?#40.1 U?#16.6)
Rx+: obc-v2_BOARD-CONNECT (J?#3.27), obc-v2_EXP-CAN-RS422 (R?#55.2 U?#20.14)
Rx-: obc-v2_BOARD-CONNECT (J?#3.28), obc-v2_EXP-CAN-RS422 (R?#55.1 U?#20.13)
Tx+: obc-v2_BOARD-CONNECT (J?#3.6), obc-v2_EXP-CAN-RS422 (R?#57.2 U?#20.11)
Tx-: obc-v2_BOARD-CONNECT (J?#3.7), obc-v2_EXP-CAN-RS422 (R?#57.1 U?#20.12)